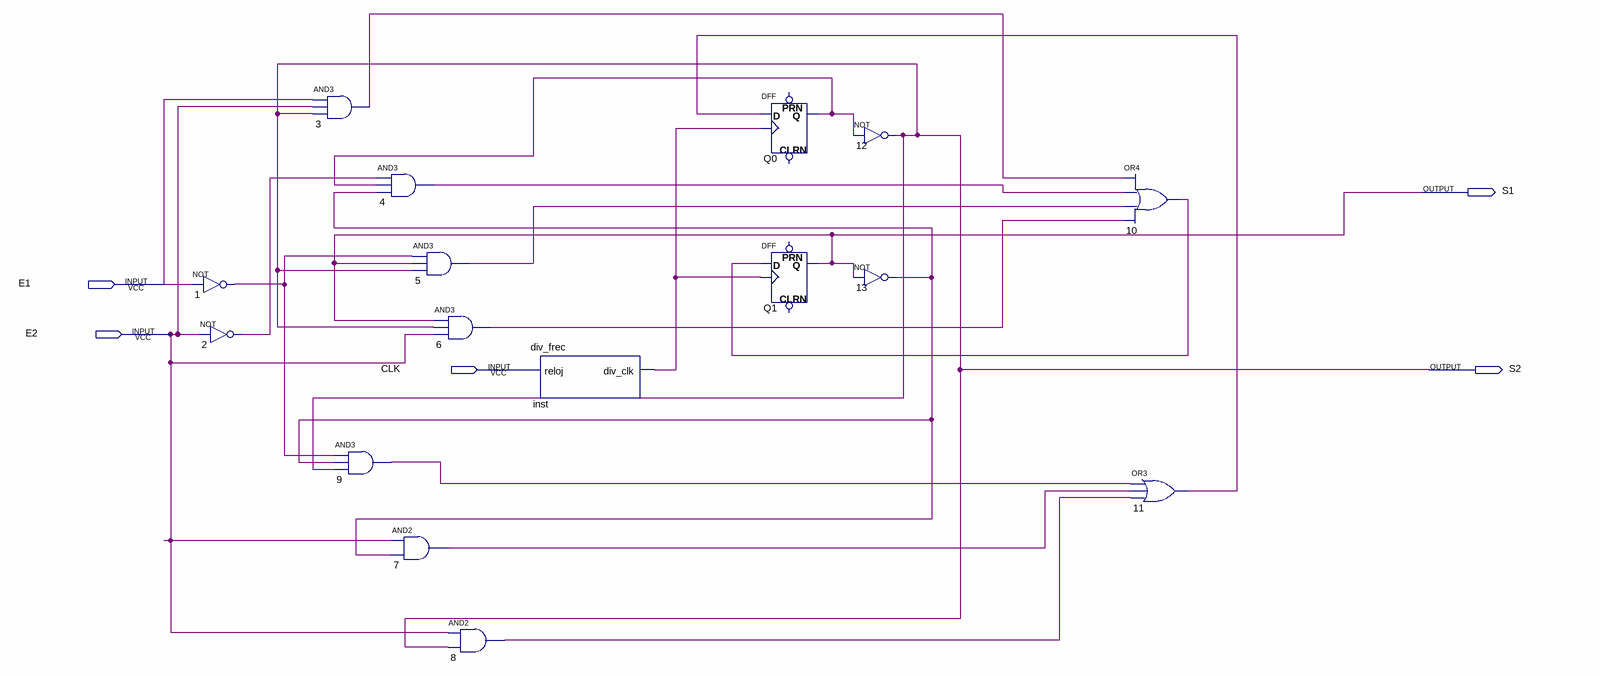
[diagram p0: schematic sheet]
// Quartus schematic Practica2.bdf as structural Verilog: 16 symbols, 5 pins
module Practica2 (
  input  E1,
  input  E2,
  input  CLK,
  output S1,
  output S2
);

  wire inst_div_clk, n1_out, n2_out, n3_out, n4_out, n5_out, n6_out, n7_out, n8_out, n9_out, n10_out,
       n11_out, n13_out, Q0_q;

  not u_1 (n1_out, E1);
  not u_2 (n2_out, E2);
  and u_3 (n3_out, E1, E2, S2);
  and u_4 (n4_out, n2_out, Q0_q, n13_out);
  and u_9 (n9_out, n1_out, n13_out, S2);
  and u_5 (n5_out, n1_out, S1, S2);
  and u_6 (n6_out, S1, S2, E2);
  and u_7 (n7_out, E2, n13_out);
  and u_8 (n8_out, E2, S2);
  div_frec inst (.reloj(CLK), .div_clk(inst_div_clk));
  DFF Q0 (.CLK(inst_div_clk), .D(n11_out), .Q(Q0_q));  // open: CLRN, PRN
  DFF Q1 (.CLK(inst_div_clk), .D(n10_out), .Q(S1));  // open: CLRN, PRN
  not u_12 (S2, Q0_q);
  not u_13 (n13_out, S1);
  or u_10 (n10_out, n3_out, n4_out, n5_out, n6_out);
  or u_11 (n11_out, n9_out, n7_out, n8_out);
endmodule
